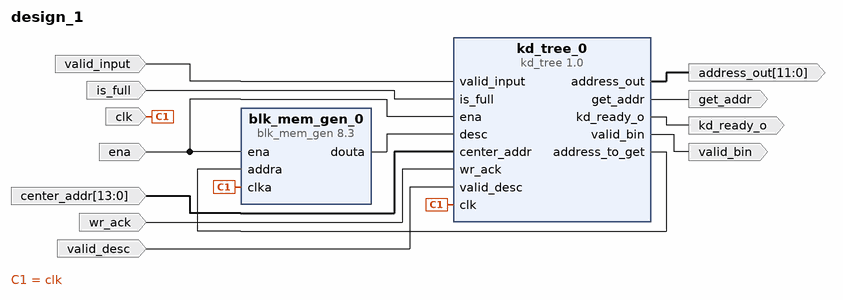
[diagram p0: block diagram of the top level]
# Vivado block design design_1, xc7z020clg484-1, Vivado 2016.4
create_bd_design design_1

create_bd_port -dir I -type clk clk
set_property -dict {CONFIG.FREQ_HZ 100000000} [get_bd_ports clk]
create_bd_port -dir I valid_input
create_bd_port -dir I is_full
create_bd_port -dir I ena
create_bd_port -dir I -from 13 -to 0 center_addr
create_bd_port -dir I wr_ack
create_bd_port -dir O valid_bin
create_bd_port -dir I valid_desc
create_bd_port -dir O get_addr
create_bd_port -dir O kd_ready_o
create_bd_port -dir O -from 11 -to 0 address_out

create_bd_cell -type ip -vlnv xilinx.com:ip:blk_mem_gen:8.3 blk_mem_gen_0
set_property -dict [list \
  CONFIG.Memory_Type Single_Port_ROM \
  CONFIG.Enable_32bit_Address false \
  CONFIG.Write_Width_A 12 \
  CONFIG.Register_PortA_Output_of_Memory_Primitives true \
  CONFIG.Fill_Remaining_Memory_Locations true \
  CONFIG.Remaining_Memory_Locations 123 \
  CONFIG.Use_RSTA_Pin false \
  CONFIG.Port_A_Write_Rate 0 \
  CONFIG.use_bram_block Stand_Alone \
] [get_bd_cells blk_mem_gen_0]
create_bd_cell -type ip -vlnv user.org:user:kd_tree:1.0 kd_tree_0
set_property -dict {CONFIG.level 11} [get_bd_cells kd_tree_0]

# ---- connections ----

connect_bd_net [get_bd_ports clk] [get_bd_pins blk_mem_gen_0/clka] [get_bd_pins kd_tree_0/clk]
connect_bd_net [get_bd_ports valid_input] [get_bd_pins kd_tree_0/valid_input]
connect_bd_net [get_bd_ports is_full] [get_bd_pins kd_tree_0/is_full]
connect_bd_net [get_bd_ports ena] [get_bd_pins blk_mem_gen_0/ena] [get_bd_pins kd_tree_0/ena]
connect_bd_net [get_bd_ports center_addr] [get_bd_pins kd_tree_0/center_addr]
connect_bd_net [get_bd_ports wr_ack] [get_bd_pins kd_tree_0/wr_ack]
connect_bd_net [get_bd_pins kd_tree_0/valid_bin] [get_bd_ports valid_bin]
connect_bd_net [get_bd_ports valid_desc] [get_bd_pins kd_tree_0/valid_desc]
connect_bd_net [get_bd_pins kd_tree_0/get_addr] [get_bd_ports get_addr]
connect_bd_net [get_bd_pins kd_tree_0/kd_ready_o] [get_bd_ports kd_ready_o]
connect_bd_net [get_bd_pins kd_tree_0/address_to_get] [get_bd_pins blk_mem_gen_0/addra]
connect_bd_net [get_bd_pins blk_mem_gen_0/douta] [get_bd_pins kd_tree_0/desc]
connect_bd_net [get_bd_pins kd_tree_0/address_out] [get_bd_ports address_out]

validate_bd_design
save_bd_design
